# EAGLE design BO (EAGLE 9.3.1)
CNAME: ATM90E36_3P4W; CREVISION: 1.0; DESIGNER: Tisham Dhar
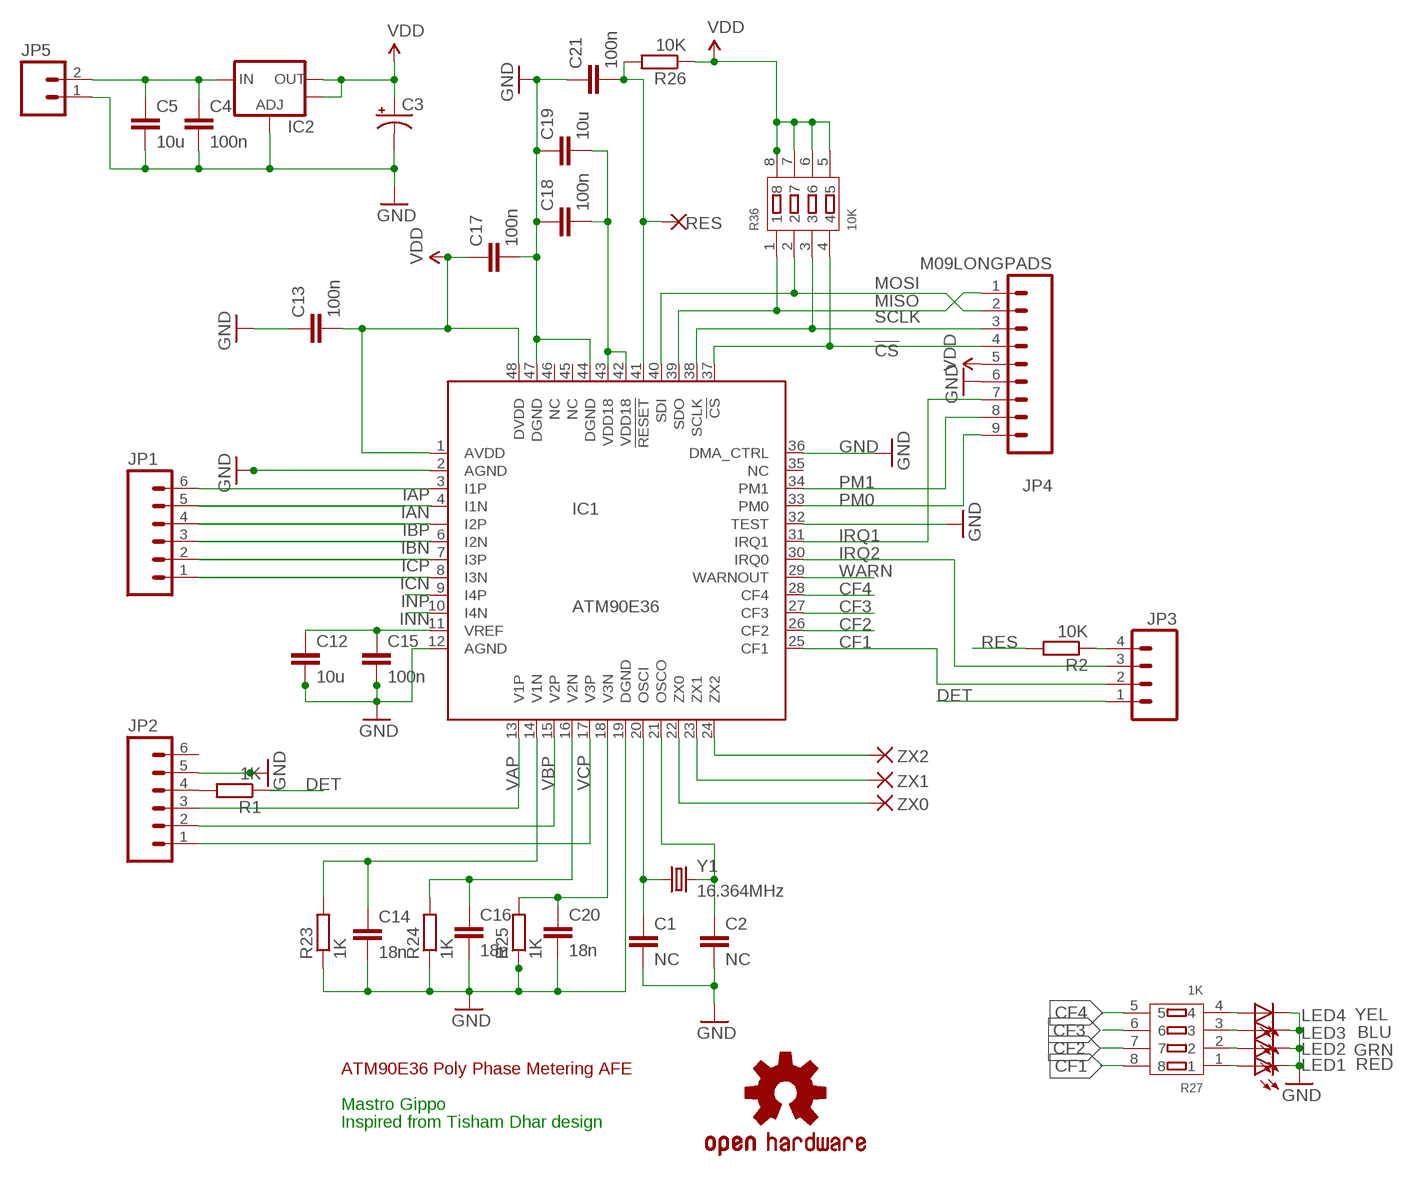
[diagram p0: schematic, sheet 1]

## Parts
C1  NC  C-EUC0805K  [C0805K]
C2  NC  C-EUC0805K  [C0805K]
C3  CPOL-USE5-6  [E5-6]
C4  100n  C-EUC0805K  [C0805K]
C5  10u  C-EUC0805K  [C0805K]
C12  10u  C-EUC0805K  [C0805K]
C13  100n  C-EUC0805K  [C0805K]
C14  18n  C-EUC0805K  [C0805K]
C15  100n  C-EUC0805K  [C0805K]
C16  18n  C-EUC0805K  [C0805K]
C17  100n  C-EUC0805K  [C0805K]
C18  100n  C-EUC0805K  [C0805K]
C19  10u  C-EUC0805K  [C0805K]
C20  18n  C-EUC0805K  [C0805K]
C21  100n  C-EUC0805K  [C0805K]
IC1  ATM90E36  [TQFP48]
IC2  V_REG_LM1117SOT223  [SOT223]
JP1  M06LONGPADS  [1X06_LONGPADS]
JP2  M06LONGPADS  [1X06_LONGPADS]
JP3  M04LONGPADS  [1X04_LONGPADS]
JP4  M09LONGPADS  [1X09_LONGPADS]
JP5  M02PTH3  [1X02_LONGPADS]
LED1  RED  LEDCHIP-LED0603  [CHIP-LED0603]
LED2  GRN  LEDCHIP-LED0603  [CHIP-LED0603]
LED3  BLU  LEDCHIP-LED0603  [CHIP-LED0603]
LED4  YEL  LEDCHIP-LED0603  [CHIP-LED0603]
LOGO1  OSHW-LOGOM  [OSHW-LOGO-M]
R1  1K  R-EU_M0805  [M0805]
R2  10K  R-EU_M0805  [M0805]
R23  1K  R-EU_M0805  [M0805]
R24  1K  R-EU_M0805  [M0805]
R25  1K  R-EU_M0805  [M0805]
R26  10K  R-EU_M0805  [M0805]
R27  1K  SMD-RES-ARRAY-1K-4R(RA1206-8)  [RA1206-8]
R36  10K  SMD-RES-ARRAY-1K-4R(RA1206-8)  [RA1206-8]
RES  ZX0  SMD2  [SMD1,27-2,54]
Y1  16.364MHz  CRYSTALSMD  [HC49UP]
ZX0  ZX0  SMD2  [SMD1,27-2,54]
ZX1  ZX1  SMD2  [SMD1,27-2,54]
ZX2  ZX0  SMD2  [SMD1,27-2,54]

## Nets
!CS: IC1.37(!CS) JP4.4 R36.4
CF1: IC1.25(CF1) JP3.2 R27.8
CF2: IC1.26(CF2) R27.7
CF3: IC1.27(CF3) R27.6
CF4: IC1.28(CF4) R27.5
DET: JP3.1 R1.1
GND [pwr]: C1.2 C2.2 C3.- C4.2 C5.2 C12.2 C13.1 C14.2 C15.2 C16.2 C17.2 C18.1 C19.1 C20.2 C21.1 IC1.2(AGND) IC1.12(AGND) IC1.19(DGND) IC1.32(TEST) IC1.36(DMA_CTRL) IC1.44(DGND) IC1.47(DGND) IC2.1(ADJ) JP2.5 JP4.6 JP5.1 LED1.C LED2.C LED3.C LED4.C R23.1 R24.1 R25.1
IAN [analog]: IC1.4(I1N) JP1.5
IAP [analog]: IC1.3(I1P) JP1.6
IBN [analog]: IC1.6(I2N) JP1.3
IBP [analog]: IC1.5(I2P) JP1.4
ICN [analog]: IC1.8(I3N) JP1.1
ICP [analog]: IC1.7(I3P) JP1.2
INN [analog]: IC1.10(I4N)
INP [analog]: IC1.9(I4P)
IRQ1: IC1.31(IRQ1) JP4.7
IRQ2: IC1.30(IRQ0) JP3.3
MISO: IC1.39(SDO) JP4.1 R36.1
MOSI: IC1.40(SDI) JP4.2 R36.2
N$1: JP3.4 R2.1
N$2: JP2.4 R1.2
N$3: LED4.A R27.4
N$4: LED3.A R27.3
N$5: LED2.A R27.2
N$6: LED1.A R27.1
N$7: C4.1 C5.1 IC2.3(IN) JP5.2
N$9: C1.1 IC1.20(OSCI) Y1.1
N$10: C2.1 IC1.21(OSCO) Y1.2
N$27 [analog]: C14.1 IC1.14(V1N) R23.2
N$29 [analog]: C16.1 IC1.16(V2N) R24.2
N$30 [analog]: C20.1 IC1.18(V3N) R25.2
N$40 [pwr]: C18.2 C19.2 IC1.42(VDD18) IC1.43(VDD18)
N$55: C12.1 C15.1 IC1.11(VREF)
PM0: IC1.33(PM0) JP4.9
PM1: IC1.34(PM1) JP4.8
RES: C21.2 IC1.41(!RESET) R2.2 R26.2 RES.1(P)
SCLK: IC1.38(SCLK) JP4.3 R36.3
VAP [analog]: IC1.13(V1P) JP2.3
VBP [analog]: IC1.15(V2P) JP2.2
VCP [analog]: IC1.17(V3P) JP2.1
VDD [pwr]: C3.+ C13.2 C17.1 IC1.1(AVDD) IC1.48(DVDD) IC2.2(OUT) IC2.4(OUT) JP4.5 R26.1 R36.5 R36.6 R36.7 R36.8
WARN: IC1.29(WARNOUT)
ZX0: IC1.22(ZX0) ZX0.1(P)
ZX1: IC1.23(ZX1) ZX1.1(P)
ZX2: IC1.24(ZX2) ZX2.1(P)
Unconnected: IC1.35(NC) IC1.45(NC) IC1.46(NC) JP2.6

## Notes on the sheet
- ATM90E36 Poly Phase Metering AFE
- Mastro Gippo
- Inspired from Tisham Dhar design

## Library data of the parts
C1 C2 C4 C5 C12-C21 = resistor:C-EU: CAPACITOR, European symbol; SPICEPREFIX: C
C3 = resistor:CPOL-US: POLARIZED CAPACITOR, American symbol
IC1 = ATM90E36:ATM90E36: ATMEL Poly-phase energy metering; OC_FARNELL: unknown; OC_NEWARK: unknown
IC2 = SparkFun:V_REG_LM1117: Voltage Regulator LM1117 Standard adjustable voltage regulator but in SMD form. Spark Fun Electronics SKU : COM-00595
JP1 JP2 = SparkFun:M06: Header 6 Standard 6-pin 0.1" header. Use with straight break away headers (SKU : PRT-00116), right angle break away headers (PRT-00553), swiss pins (PRT-00743), machine pins (PRT-00117), and female headers (PRT-00115). Molex polarized connector foot print use with SKU : PRT-08094 with associated crimp pins and housings. NOTES ON THE VARIANTS LOCK and LOCK_LONGPADS... This footprint was designed to help hold the alignment of a through-hole component (i.e. 6-pin header) while soldering it into place. You may notice that each hole has been shifted either up or down by 0.005 of an inch from it's more standard position (which is a perfectly straight line). This slight alteration caused the pins (the squares in the middle) to touch the edges of the holes. Because they are alternating, it causes a "brace" to hold the component in place. 0.005 has proven to be the perfect amount of "off-center" position when using our standard breakaway headers. Although looks a little odd when you look at the bare footprint, once you have a header in there, the alteration is very hard to notice. Also, if you push a header all the way into place, it is covered up entirely on the bottom side. This idea of altering the position of holes to aid alignment will be further integrated into the Sparkfun Library for other footprints. It can help hold any component with 3 or more connection pins.
JP3 = SparkFun:M04: Header 4 Standard 4-pin 0.1" header. Use with straight break away headers (SKU : PRT-00116), right angle break away headers (PRT-00553), swiss pins (PRT-00743), machine pins (PRT-00117), and female headers (PRT-00115). Molex polarized connector foot print use with SKU : PRT-08231 with associated crimp pins and housings. 1MM SMD Version SKU: PRT-10208
JP4 = SparkFun:M09: Header 9 Standard 9-pin 0.1" header. Use with straight break away headers (SKU : PRT-00116), right angle break away headers (PRT-00553), swiss pins (PRT-00743), machine pins (PRT-00117), and female headers (PRT-00115).
JP5 = SparkFun:M02: Header 2 Standard 2-pin 0.1" header. Use with straight break away headers (SKU : PRT-00116), right angle break away headers (PRT-00553), swiss pins (PRT-00743), machine pins (PRT-00117), and female headers (PRT-00115). Molex polarized connector foot print use with SKU : PRT-08233 with associated crimp pins and housings.
LED1-LED4 = adafruit:LED: LED OSRAM: - CHIPLED LG R971, LG N971, LY N971, LG Q971, LY Q971, LO R971, LY R971 LH N974, LH R974 LS Q976, LO Q976, LY Q976 LO Q996 - Hyper CHIPLED LW Q18S LB Q993, LB Q99A, LB R99A - SideLED LS A670, LO A670, LY A670, LG A670, LP A670 LB A673, LV A673, LT A673, LW A673 LH A674 LY A675 LS A676, LA A676, LO A676, LY A676, LW A676 LS A679, LY A679, LG A679 - Hyper Micro SIDELED® LS Y876, LA Y876, LO Y876, LY Y876 LT Y87S - SmartLED LW L88C, LW L88S LB L89C, LB L89S, LG L890 LS L89K, LO L89K, LY L89K LS L896, LA L896, LO L896, LY L896 - TOPLED LS T670, LO T670, LY T670, LG T670, LP T670 LSG T670, LSP T670, LSY T670, LOP T670, LYG T670 LG T671, LOG T671, LSG T671 LB T673, LV T673, LT T673, LW T673 LH T674 LS T676, LA T676, LO T676, LY T676, LB T676, LH T676, LSB T676, LW T676 LB T67C, LV T67C, LT T67C, LS T67K, LO T67K, LY T67K, LW E67C LS E67B, LA E67B, LO E67B, LY E67B, LB E67C, LV E67C, LT E67C LW T67C LS T679, LY T679, LG T679 LS T770, LO T770, LY T770, LG T770, LP T770 LB T773, LV T773, LT T773, LW T773 LH T774 LS E675, LA E675, LY E675, LS T675 LS T776, LA T776, LO T776, LY T776, LB T776 LHGB T686 LT T68C, LB T68C - Hyper Mini TOPLED® LB M676 - Mini TOPLED Santana® LG M470 LS M47K, LO M47K, LY M47K Source: http://www.osram.convergy.de/
LOGO1 = SparkFun-Aesthetics:OSHW-LOGO: Open Source Hardware Logo This logo indicates the piece of hardware it is found on incorporates a OSHW license and/or adheres to the definition of open source hardware found here: http://freedomdefined.org/OSHW
R1 R2 R23-R26 = resistor:R-EU_: RESISTOR, European symbol; SPICEPREFIX: R
R27 = Seeed-Resistor-2016:SMD-RES-ARRAY-1K-4R(RA1206-8): 301030012; MPN: Chip-Array-Series-1%
R36 = Seeed-Resistor-2016:SMD-RES-ARRAY-1K-4R(RA1206-8): 301030012; MPN: Chip-Array-Series-1%; VALUE: 1K
RES ZX0 ZX1 ZX2 = wirepad:SMD2: SMD PAD
Y1 = SparkFun:CRYSTAL: Crystals Various standard crystals. Proven footprints. Spark Fun Electronics SKU : COM-00534

## Net classes
0 default: width 0.152 mm, drill 0.33 mm, clearance 0.152 mm
1 pwr: width 0.305 mm, drill 0.356 mm, clearance 0.152 mm
2 analog: width 0.305 mm, drill 0.33 mm, clearance 0.152 mm

## Board
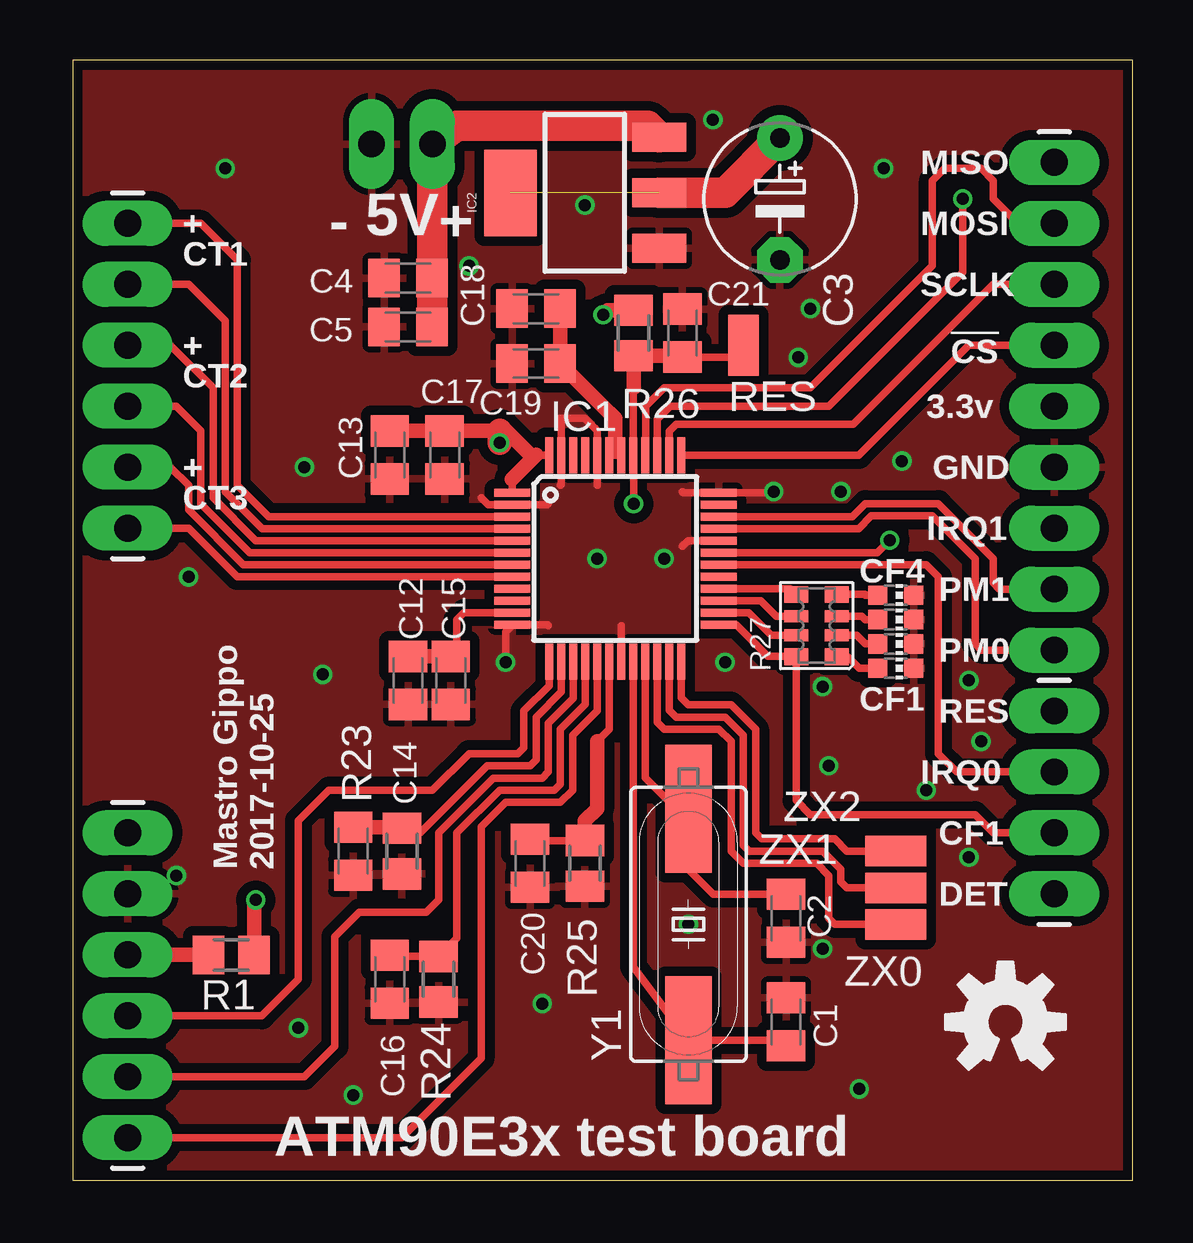
[diagram p1: board, top side]
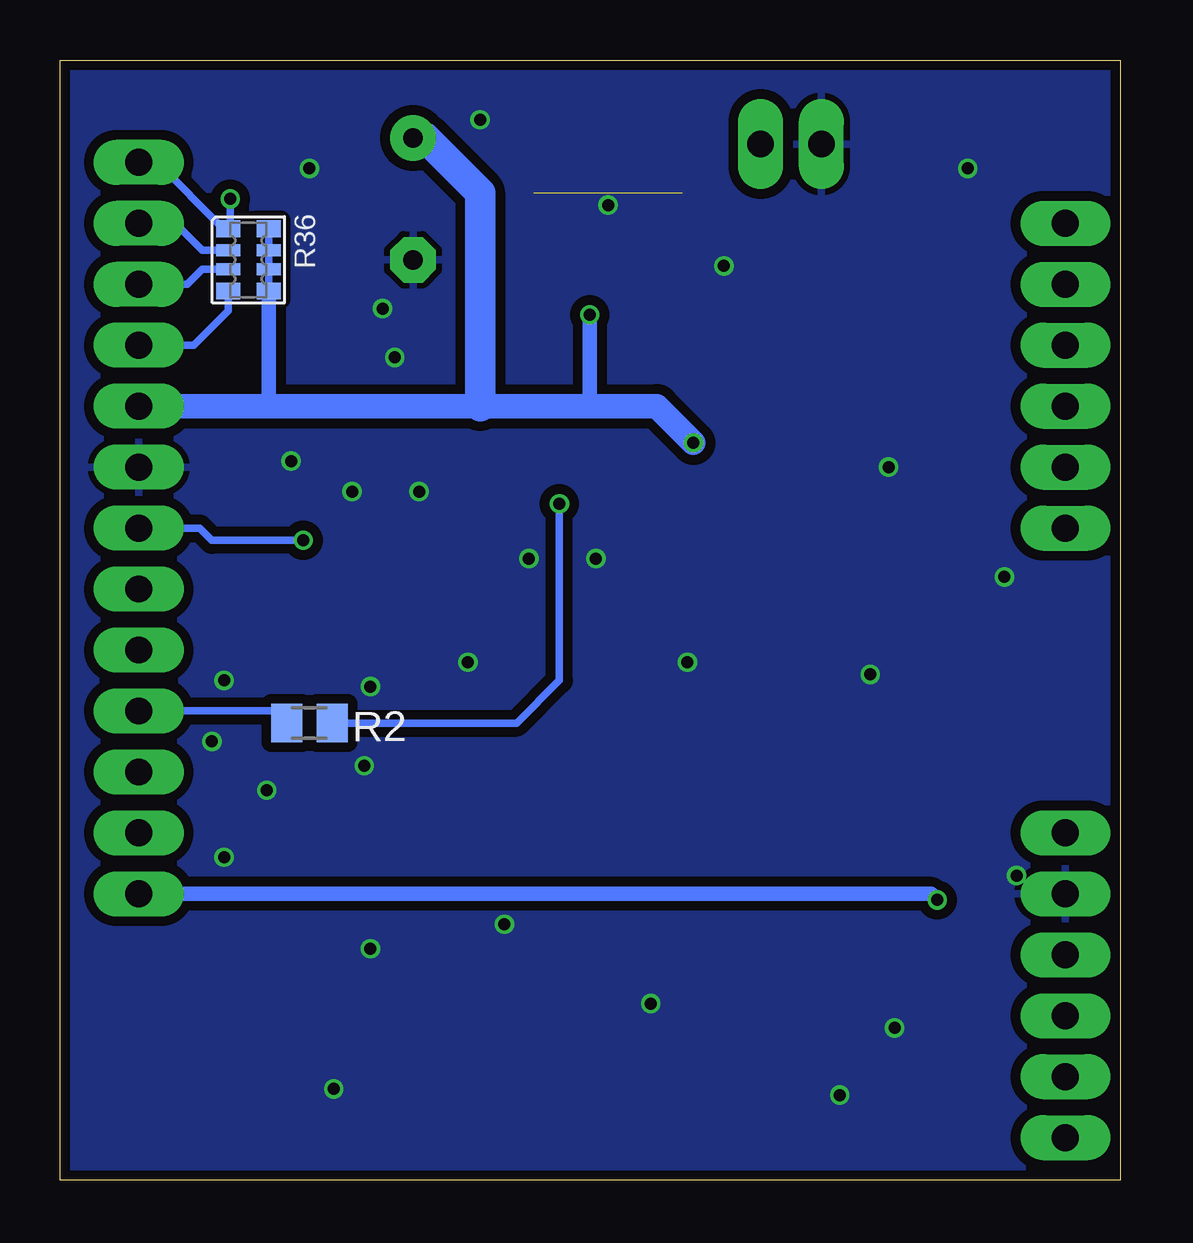
[diagram p2: board, bottom side, seen from below]

Size 44.17 x 46.68 mm. Coordinates in mm from the lower left corner, seen from the top.
Outline: 0,0 44.17,0 44.17,46.68 0,46.68 0,0
Copper layers (1*16): Top 0.035mm / dielectric 1.5mm / Bottom 0.035mm
Design rules "ITEADstudio_DRC": minimum track width 6mil, minimum drill 12mil, track to track 6mil, track to pad 6mil, pad to pad 6mil, via to via 6mil, smd to smd 0mil, copper to edge 10mil, drill to drill 10mil, minimum pad ring 10mil, minimum via ring 6mil, stop-mask expansion 2mil, vias tented up to drill 100mil, thermal gap 10mil

### Footprints (pad centres in the part's own frame; a part is rotated, then mirrored left to right if it is on the bottom)
C0805K = smd 1.3 x 1.6: 1 -1,0; 2 1,0
E5-6 = drill 0.813 pad 1.905: + -2.54,0 | drill 0.813 pad 1.905 octagon: - 2.54,0
TQFP48 = smd 1.499 x 0.33: 1 -4.3,2.75; 2 -4.3,2.25; 3 -4.3,1.75; 4 -4.3,1.25; 5 -4.3,0.75; 6 -4.3,0.25; 7 -4.3,-0.25; 8 -4.3,-0.75; 9 -4.3,-1.25; 10 -4.3,-1.75; 11 -4.3,-2.25; 12 -4.3,-2.75; 25 4.3,-2.75; 26 4.3,-2.25; 27 4.3,-1.75; 28 4.3,-1.25; 29 4.3,-0.75; 30 4.3,-0.25; 31 4.3,0.25; 32 4.3,0.75; 33 4.3,1.25; 34 4.3,1.75; 35 4.3,2.25; 36 4.3,2.75 | smd 0.33 x 1.499: 13 -2.75,-4.3; 14 -2.25,-4.3; 15 -1.75,-4.3; 16 -1.25,-4.3; 17 -0.75,-4.3; 18 -0.25,-4.3; 19 0.25,-4.3; 20 0.75,-4.3; 21 1.25,-4.3; 22 1.75,-4.3; 23 2.25,-4.3; 24 2.75,-4.3; 37 2.75,4.3; 38 2.25,4.3; 39 1.75,4.3; 40 1.25,4.3; 41 0.75,4.3; 42 0.25,4.3; 43 -0.25,4.3; 44 -0.75,4.3; 45 -1.25,4.3; 46 -1.75,4.3; 47 -2.25,4.3; 48 -2.75,4.3
SOT223 = smd 1.219 x 2.235: 1 -2.311,-3.099; 2 0,-3.099; 3 2.311,-3.099 | smd 3.6 x 2.2: 4 0,3.099
1X06_LONGPADS = drill 1.118 pad 1.88 long: 1 0,0; 2 2.54,0; 3 5.08,0; 4 7.62,0; 5 10.16,0; 6 12.7,0
1X04_LONGPADS = drill 1.118 pad 1.88 long: 1 0,0; 2 2.54,0; 3 5.08,0; 4 7.62,0
1X09_LONGPADS = drill 1.118 pad 1.88 long: 1 0,0; 2 2.54,0; 3 5.08,0; 4 7.62,0; 5 10.16,0; 6 12.7,0; 7 15.24,0; 8 17.78,0; 9 20.32,0
1X02_LONGPADS = drill 1.118 pad 1.88 long: 1 0,0; 2 2.54,0
CHIP-LED0603 = smd 0.8 x 0.8: A 0,-0.75; C 0,0.75
M0805 = smd 1.3 x 1.6: 1 -0.95,0; 2 0.95,0
RA1206-8 = smd 0.7 x 1: 1 -1.3,-0.85; 4 1.3,-0.85; 5 1.3,0.85; 8 -1.3,0.85 | smd 0.5 x 1: 2 -0.4,-0.85; 3 0.4,-0.85; 6 0.4,0.85; 7 -0.4,0.85
SMD1,27-2,54 = smd 1.27 x 2.54: 1 0,0
HC49UP = smd 5.334 x 1.93: 1 -4.826,0; 2 4.826,0

### Placement (x,y rotation side)
C1  29.72,6.6 90 top
C2  29.72,10.92 270 top
C3  29.46,40.89 270 top
C4  13.97,37.59 180 top
C5  13.97,35.56 180 top
C12  13.97,20.83 270 top
C13  13.21,30.23 90 top
C14  11.68,13.72 270 top
C15  15.75,20.83 270 top
C16  13.21,8.38 270 top
C17  15.49,30.23 270 top
C18  19.3,36.32 0 top
C19  19.3,34.04 0 top
C20  19.05,13.21 270 top
C21  25.4,35.31 270 top
IC1  22.61,25.91 0 top
IC2  21.34,41.15 90 top
JP1  2.29,27.18 90 top
JP2  2.29,1.78 90 top
JP3  40.89,11.94 90 top
JP4  40.89,42.42 270 top
JP5  12.45,43.18 0 top
LED1  34.29,21.34 270 top
LED2  34.29,22.35 270 top
LED3  34.29,23.37 270 top
LED4  34.29,24.38 270 top
LOGO1  38.86,6.6 0 top
R1  6.6,9.4 180 top
R2  33.78,19.05 0 bottom
R23  13.72,13.72 90 top
R24  15.24,8.38 90 top
R25  21.34,13.21 90 top
R26  23.37,35.31 270 top
R27  30.99,23.11 90 top
R36  36.32,38.35 270 bottom
RES  27.94,34.8 180 top
Y1  25.65,10.67 90 top
ZX0  34.29,10.67 90 top
ZX1  34.29,12.19 90 top
ZX2  34.29,13.72 90 top

### Tracks (layer width: path | path; a pad name or v marks a point on that pad's centre or on a via)
!CS
  Top 0.305: IC1.37 32.75,30.21 37.34,34.8 JP4.4
  Bottom 0.305: R36.4 37.17,36.23 38.61,34.8 JP4.4
CF1
  Top 0.305: IC1.25 27.64,23.16 28.96,21.84 30.11,21.84 R27.8 30.14,15.84 30.73,15.24 37.59,15.24 38.35,14.48 JP3.2
CF2
  Top 0.305: R27.7 29.1,22.71 28.16,23.66 IC1.26
CF3
  Top 0.305: IC1.27 28.67,24.16 29.32,23.51 R27.6
CF4
  Top 0.305: IC1.28 29.89,24.66 R27.5
DET  (via drill 0.5)
  Top 0.61: R1.1 7.55,11.62 v7.62,11.68
  Bottom 0.61: v7.62,11.68 7.87,11.94 JP3.1
GND  (via drill 0.5)
  Top 0.305: IC1.19 22.86,23.11 | IC1.12 19.77,23.16 19.81,23.11 | v18.03,21.59 18.03,22.86 18.29,23.11 | 17.02,28.45 17.31,28.16 IC1.2 19.78,28.16 19.81,28.19 | 20.32,28.96 20.36,28.99 IC1.47 20.36,31.71 20.32,31.75 21.34,31.75 21.84,31.24 21.84,30.99 | IC1.44 21.86,28.97 21.84,28.96 | 25.4,28.7 25.44,28.66 IC1.36 29.17,28.66 v29.21,28.7 | IC1.32 25.64,26.66 25.4,26.42
  other vias: 9.65,29.72 21.84,25.91 27.18,21.59 35.56,16.26 37.85,18.29 30.73,36.32 6.35,42.16 4.83,25.15 11.68,3.56 9.4,6.35 19.56,7.37 25.65,10.67 31.24,9.65 16.51,38.1 33.78,42.16 21.34,40.64 30.23,34.29 26.67,44.2 34.54,29.97 10.41,21.08 4.32,12.7 32.77,3.81 24.64,25.91 31.24,20.57 37.34,20.83 32,28.7 37.34,13.46 31.5,17.27
  pour Top (isolate 0.406): 0,51.05 49.02,51.05 49.02,0 0,0
  pour Bottom (isolate 0.406): 0,51.05 49.02,51.05 49.02,0 0,0
IAN
  Top 0.305: IC1.4 7.89,27.16 6.35,28.7 6.35,35.81 4.83,37.34 JP1.5
IAP
  Top 0.305: IC1.3 8.16,27.66 6.86,28.96 6.86,38.35 5.33,39.88 JP1.6
IBN
  Top 0.305: IC1.6 7.37,26.16 5.33,28.19 5.33,31.24 4.32,32.26 JP1.3
IBP
  Top 0.305: IC1.5 7.63,26.66 5.84,28.45 5.84,33.02 4.06,34.8 JP1.4
ICN
  Top 0.305: IC1.8 6.85,25.16 4.83,27.18 JP1.1
ICP
  Top 0.305: IC1.7 7.11,25.66 4.83,27.94 4.83,28.96 4.06,29.72 JP1.2
IRQ1  (via drill 0.5)
  Top 0.305: IC1.31 33.52,26.16 v34.04,26.67
  Bottom 0.305: v34.04,26.67 37.85,26.67 38.35,27.18 JP4.7
IRQ2
  Top 0.305: IC1.30 35.56,25.66 36.07,25.15 36.07,17.78 36.83,17.02 JP3.3
MISO  (via drill 0.5)
  Top 0.305: IC1.39 24.36,31.72 24.89,32.26 31.5,32.26 37.08,37.85 v37.08,40.89
  Bottom 0.305: JP4.1 40.13,42.42 37.37,39.65 R36.1 37.08,39.74 v37.08,40.89
MOSI
  Top 0.305: IC1.40 23.88,30.23 23.88,32.26 24.64,33.02 30.73,33.02 35.81,38.1 35.81,41.66 36.32,42.16 37.85,42.16 38.35,41.66 38.35,40.89 39.37,39.88 JP4.2
  Bottom 0.305: R36.2 38.25,38.75 39.37,39.88 JP4.2
N$1
  Bottom 0.305: JP3.4 35.24,19.56 R2.1
N$2
  Top 0.61: JP2.4 R1.2
N$3
  Top 0.305: R27.4 32.99,24.41 33.02,24.38 LED4.A
N$4
  Top 0.305: R27.3 32.87,23.51 33.02,23.37 LED3.A
N$5
  Top 0.305: R27.2 32.66,22.71 33.02,22.35 LED2.A
N$6
  Top 0.305: R27.1 32.29,21.81 32.77,21.34 LED1.A
N$7
  Top 1.27: C5.1 C4.1 14.99,37.61 JP5.2 16,43.94 23.95,43.94 IC2.3
N$9
  Top 0.305: IC1.20 23.36,8.9 Y1.1 30.21,5.84 C1.1
N$10
  Top 0.305: IC1.21 23.86,16.78 25.15,15.49 Y1.2 25.65,12.95 26.69,11.92 C2.1
N$27
  Top 0.305: IC1.14 20.36,20.36 19.3,19.3 19.3,17.53 19.05,17.27 17.27,17.27 14.48,14.48 13.9,14.48 R23.2
  Top 0.61: C14.1 13.67,14.72 R23.2
N$29
  Top 0.305: IC1.16 21.36,19.83 20.32,18.8 20.32,16.51 20.07,16.26 17.78,16.26 16,14.48 16,10.09 R24.2 13.26,9.33 C16.1
N$30
  Top 0.305: IC1.18 22.36,18.8 21.84,18.29 | R25.2 18.85,14.16 C20.1
  Top 0.61: 21.84,18.29 21.84,15.49 21.34,14.99 R25.2
N$40
  Top 0.305: IC1.42 IC1.43 22.61,30.46
  Top 0.61: C18.2 C19.2 22.36,31.98 22.37,31.98 22.61,31.75 22.61,30.46
N$55
  Top 0.305: IC1.11 16.29,23.66 16,23.37 16,22.08 C15.1
  Top 0.61: C12.1 C15.1
PM0
  Top 0.305: JP4.9 37.85,22.1 37.59,22.35 37.59,25.91 35.81,27.69 33.27,27.69 32.75,27.16 IC1.33
PM1
  Top 0.305: JP4.8 38.61,24.64 38.35,24.89 38.35,25.91 36.07,28.19 33.02,28.19 32.48,27.66 IC1.34
RES  (via drill 0.5)
  Top 0.305: 23.37,33.02 23.36,33.01 IC1.41 23.37,30.2 v23.37,28.19 | C21.2 27.45,34.31 RES.1
  Top 0.61: 23.37,33.02 R26.2 25.1,34.36 C21.2
  Bottom 0.305: v23.37,28.19 23.37,20.83 25.15,19.05 R2.2
SCLK
  Top 0.305: IC1.38 24.86,31.21 25.15,31.5 32.51,31.5 38.35,37.34 JP4.3
  Bottom 0.305: R36.3 38.25,37.95 38.86,37.34 JP4.3
VAP
  Top 0.305: IC1.13 19.86,20.62 18.8,19.56 18.8,18.03 18.54,17.78 16.51,17.78 14.99,16.26 10.67,16.26 9.4,14.99 9.4,8.38 7.87,6.86 JP2.3
VBP
  Top 0.305: IC1.15 20.86,20.09 19.81,19.05 19.81,17.02 19.56,16.76 17.53,16.76 15.24,14.48 15.24,11.68 14.73,11.18 11.94,11.18 10.92,10.16 10.92,5.59 9.65,4.32 JP2.2
VCP
  Top 0.305: IC1.17 21.86,19.57 20.83,18.54 20.83,16.26 20.32,15.75 18.03,15.75 17.02,14.73 17.02,5.08 13.72,1.78 JP2.1
VDD  (via drill 0.5)  (1 unrouted)
  Top 0.305: IC1.1 18.31,29.19 18.29,29.21 | IC1.48 19.32,30.21 19.3,30.23
  Top 0.61: 18.29,29.21 19.18,30.1 | 19.18,30.1 19.3,30.23 | 19.18,30.1 18.05,31.23 17.78,31.23 C17.1 C13.2 | R26.1 22.29,36.26 v22.1,36.07
  Top 1.016: v17.78,30.73 17.78,31.23
  Top 1.27: IC2.2 27.18,41.15 C3.+
  Bottom 0.305: R36.8 R36.7 R36.6 R36.5
  Bottom 0.61: R36.5 35.47,32.42 35.31,32.26 | v22.1,36.07 22.1,32.51 21.84,32.26
  Bottom 1.016: JP4.5 35.31,32.26 26.67,32.26 21.84,32.26 19.3,32.26 v17.78,30.73
  Bottom 1.27: C3.+ 28.96,43.43 26.67,41.15 26.67,32.26
ZX0
  Top 0.305: IC1.22 24.36,19.08 24.64,18.8 26.92,18.8 27.43,18.29 27.43,13.72 27.94,13.21 30.99,13.21 31.5,12.7 31.5,10.92 31.75,10.67 ZX0.1 34.54,10.67
ZX1
  Top 0.305: IC1.23 24.86,19.59 25.15,19.3 27.18,19.3 27.94,18.54 27.94,13.97 28.19,13.72 31.24,13.72 32,12.95 32,12.45 32.26,12.19 ZX1.1
ZX2
  Top 0.305: IC1.24 25.36,20.11 25.65,19.81 27.43,19.81 28.45,18.8 28.45,14.48 28.7,14.22 31.75,14.22 32.26,13.72 ZX2.1

### Text on the board
tNames: MISO | + | - | 5V | + | MOSI | CT1 | SCLK | + | !CS | CT2 | 3.3v | + | GND | CT3 | IRQ1 | CF4 | PM1 | PM0 | CF1 | RES | IRQ0 | CF1 | Mastro Gippo / 2017-10-25 | DET | ATM90E3x test board